# Altium project PKE_T.PrjPcb
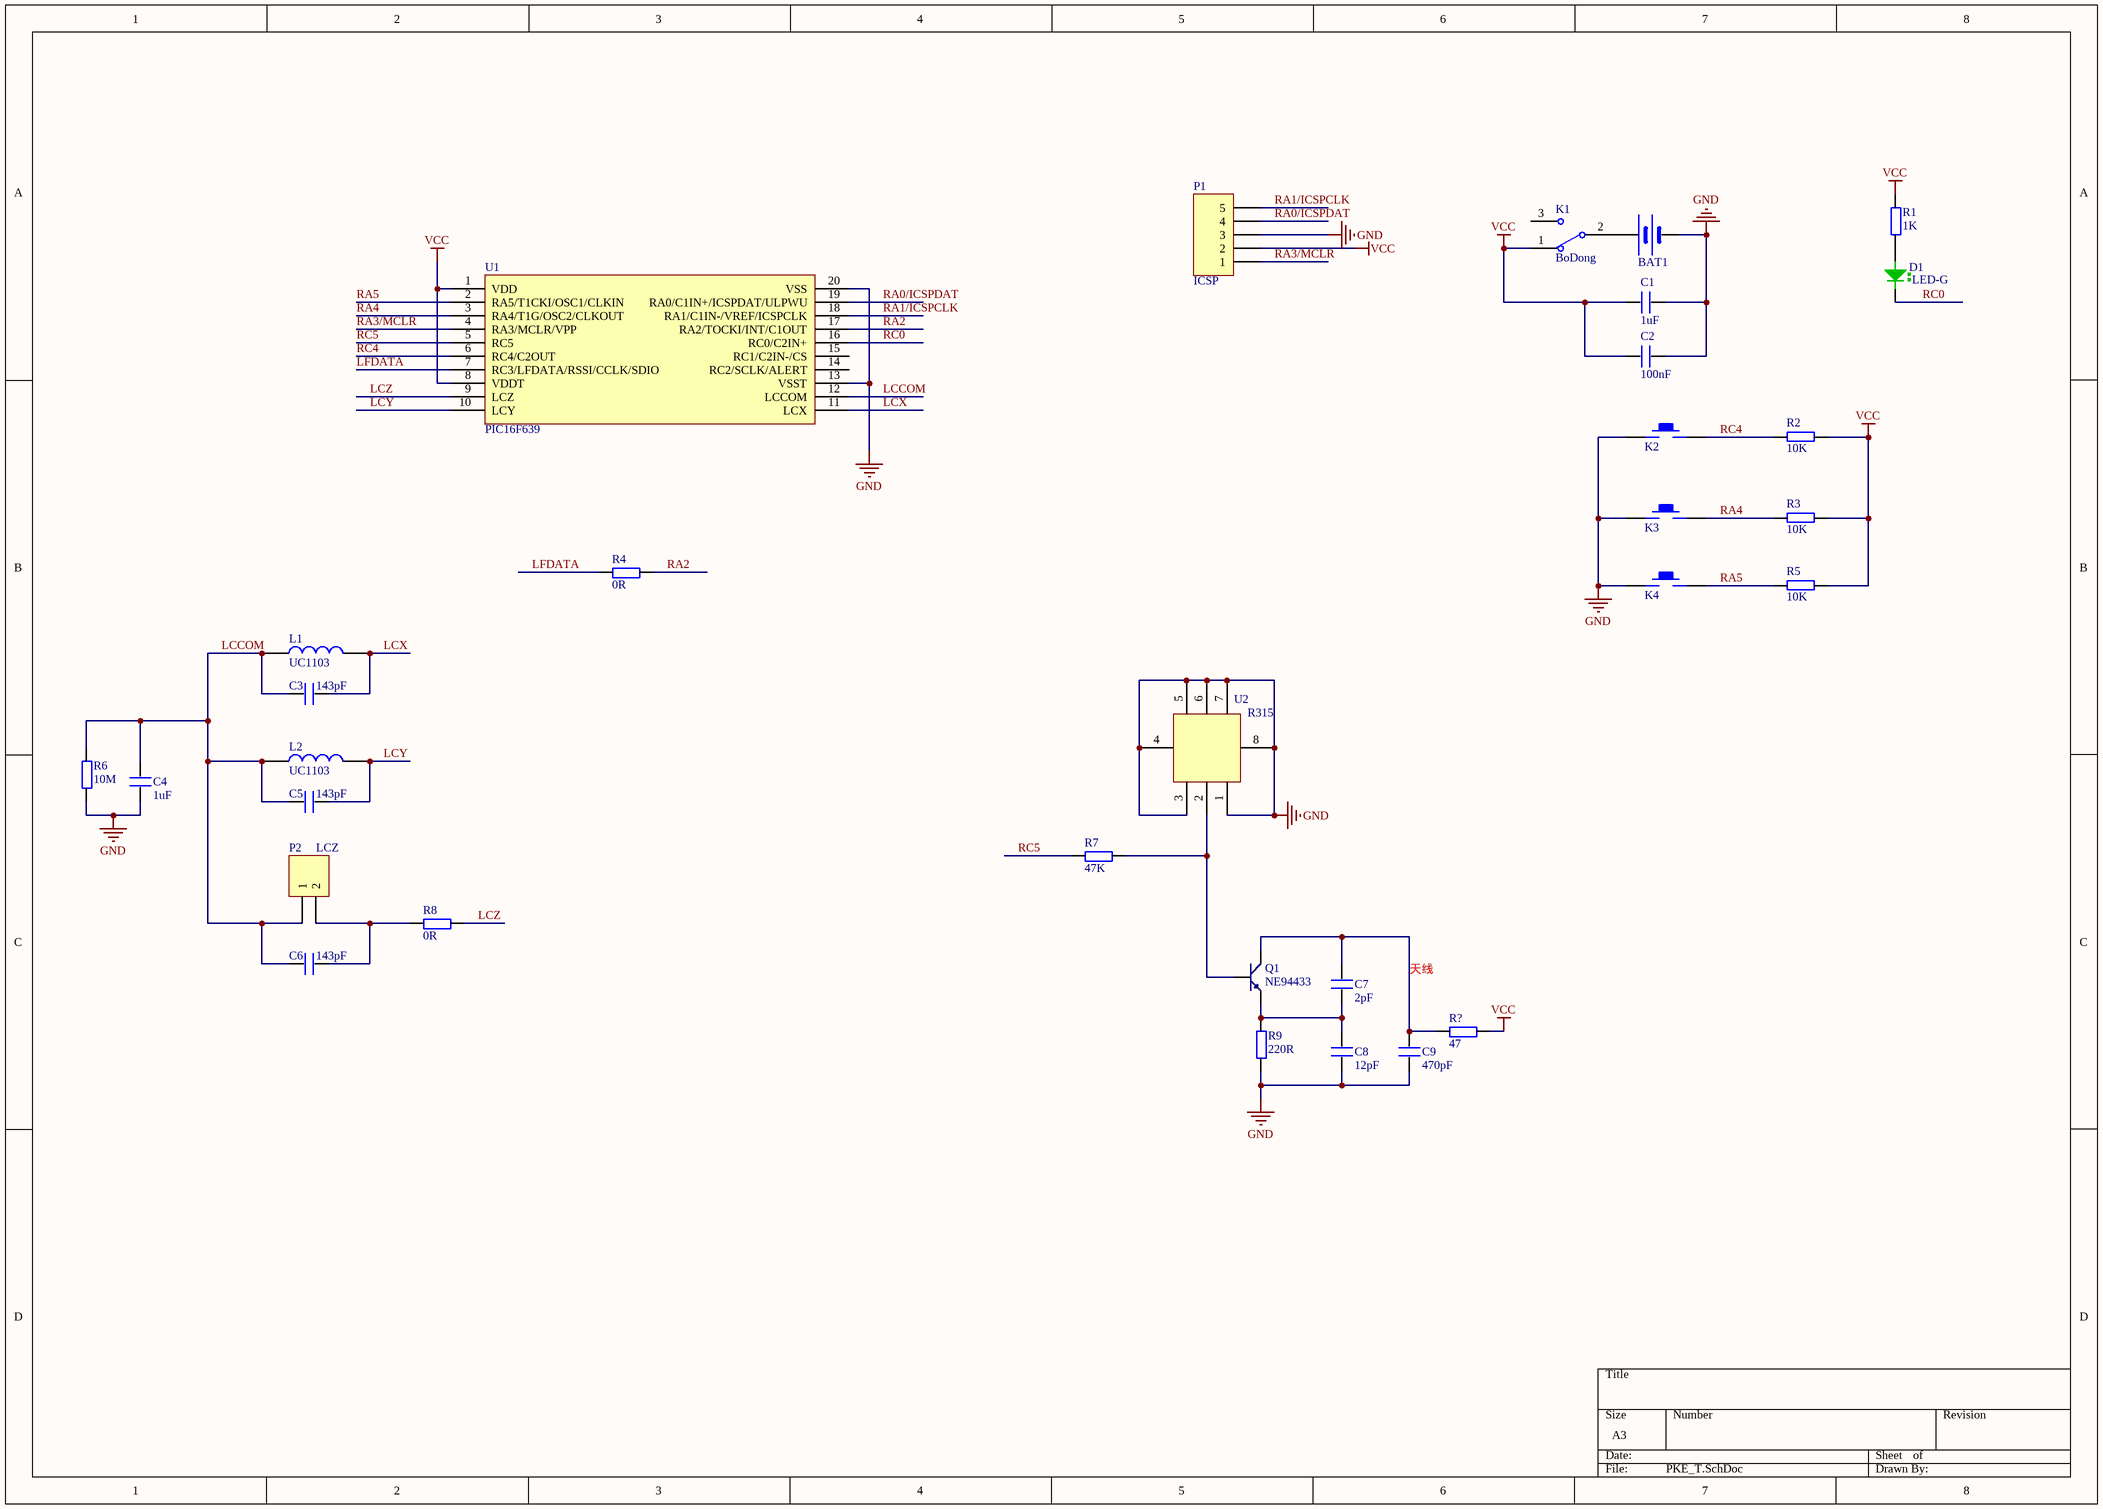
[diagram p0: PKE_T.SchDoc]
1 sheet, 32 parts. Net scope: global (net labels, ports and power ports of the same name join across sheets).
Board files: 05-01889R2.3B_发送.PcbDoc, 05-01891R2.1T_接收.PcbDoc, 05-01891R2.1T_接收+433.PcbDoc, 05-01891R2.1T_接收+NRF2401.PcbDoc

## Sheet PKE_T.SchDoc
size A3

### Parts
BAT1  BATT  [CR2032_Shell]  (value not drawn)
C1  1uF  [0805-CAP]
C2  100nF  [0805-CAP]
C3  143pF  [0805-CAP]
C4  1uF  [0805-CAP]
C5  143pF  [0805-CAP]
C6  143pF  [0805-CAP]
C7  2pF  [0603P]
C8  12pF  [0603P]
C9  470pF  [0603P]
D1  LED-G  [0805-LED]
K1  BoDong  [MSK-12C01]
K2  KEY_M  [KEY_3*6*2.5mm]  (value not drawn)
K3  KEY_M  [KEY_3*6*2.5mm]  (value not drawn)
K4  KEY_M  [KEY_3*6*2.5mm]  (value not drawn)
L1  UC1103  [PKE_XY_Rev_Ant]
L2  UC1103  [PKE_XY_Rev_Ant]
P1  ICSP  [HDR1X5]
P2  LCZ  [HDR1X2]
Q1  NE94433  [SOT-23R]
R1  1K  [0603P]
R2  10K  [0603P]
R3  10K  [0603P]
R4  0R  [0603P]
R5  10K  [0603P]
R6  10M  [0805-RES]
R7  47K  [0603P]
R8  0R  [0603P]
R9  220R  [0603P]
R?  47  [0603P]
U1  PIC16F639  [SSOP-5.3mm-20]
U2  R315  [QCC8C]

### Nets
GND: BAT1.2(GND) C1.2 C2.2 C4.1 C8.1 C9.1 K2.1 K3.1 K4.1 P1.3 R6.1 R9.1 U1.13(VSST) U1.20(VSS) U2.1 U2.3 U2.4 U2.5 U2.6 U2.7 U2.8
VCC: C1.1 C2.1 K1.1 P1.2 R1.2 R2.1 R3.1 R5.1 R?.2 U1.1(VDD) U1.8(VDDT)
LCCOM: C3.1 C4.2 C5.1 C6.1 L1.1 L2.1 P2.1 R6.2 U1.12(LCCOM)
LCX: C3.2 L1.2 U1.11(LCX)
LCY: C5.2 L2.2 U1.10(LCY)
LCZ: R8.2 U1.9(LCZ)
LFDATA: R4.1 U1.7(RC3/LFDATA/RSSI/CCLK/SDIO)
RA0/ICSPDAT: P1.4 U1.19(RA0/C1IN+/ICSPDAT/ULPWU)
RA1/ICSPCLK: P1.5 U1.18(RA1/C1IN-/VREF/ICSPCLK)
RA2: R4.2 U1.17(RA2/TOCKI/INT/C1OUT)
RA3/MCLR: P1.1 U1.4(RA3/MCLR/VPP)
RA4: K3.2 R3.2 U1.3(RA4/T1G/OSC2/CLKOUT)
RA5: K4.2 R5.2 U1.2(RA5/T1CKI/OSC1/CLKIN)
RC0: D1.2 U1.16(RC0/C2IN+)
RC4: K2.2 R2.2 U1.6(RC4/C2OUT)
RC5: R7.1 U1.5(RC5)
NetBAT1_1: BAT1.1(VCC) K1.2
NetC6_2: C6.2 P2.2 R8.1
NetC7_1: C7.1 C8.2 Q1.2(E) R9.2
NetC7_2: C7.2 C9.2 Q1.3(C) R?.1
NetD1_1: D1.1 R1.1
NetQ1_1: Q1.1(B) R7.2 U2.2

Not connected (* = marked no-connect by the designer): K1 3; U1 14(RC2/SCLK/ALERT) 15(RC1/C2IN-/CS)

### Notes on the sheet
- 天线

### Library data of the parts
BAT1 = BAT
C1-C9 = C
D1 = LED-GRE: 绿色LED
K1 = KEY_BoDong
L1 L2 = ANT_PKE_XY: PKE单轴接收天线
P1 = Header 5: Header, 5-Pin; LatestRevisionDate: 17-Jul-2002; LatestRevisionNote: Re-released for DXP Platform.; Publisher: Altium Limited
P2 = Header 2: Header, 2-Pin; LatestRevisionDate: 17-Jul-2002; LatestRevisionNote: Re-released for DXP Platform.; Publisher: Altium Limited
R1-R9 R? = Res
U1 = PIC16F639: +AFE
U2 = R315: 声表